# EAGLE schematic lab9 (EAGLE 7.0.0)
Lab 3 Jonathan Valvano
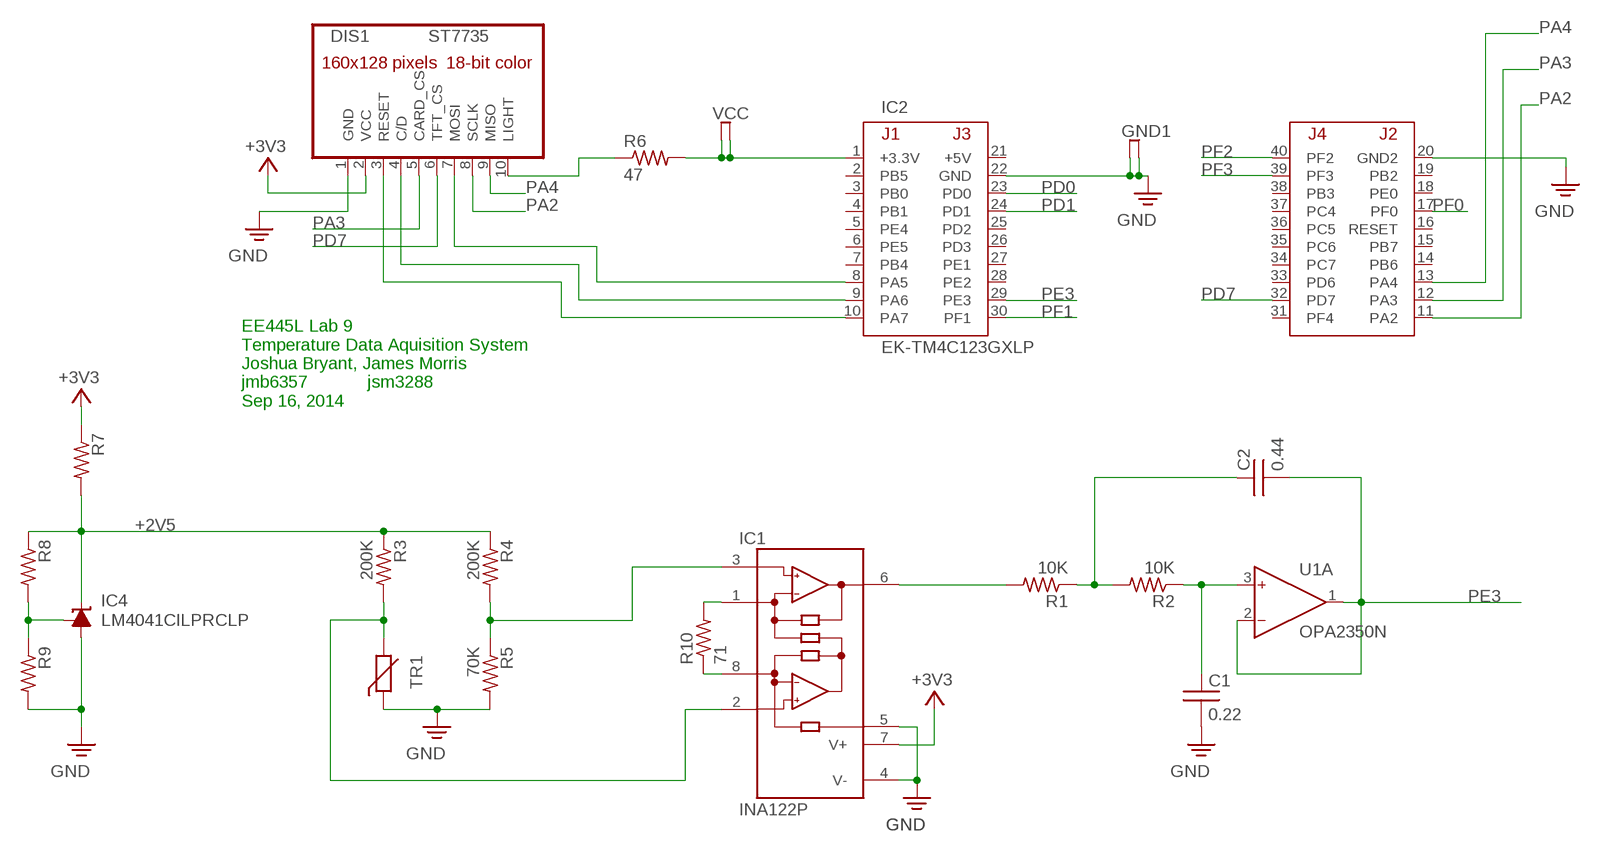
[diagram p0: schematic, sheet 1]

## Parts
C1  0.22  CAPACITOR050-024X044  [CAP200MIL]
C2  0.44  CAPACITOR050-024X044  [CAP200MIL]
DIS1  ST7735  [ST7735]
GND1  TP2  [TP2]
IC1  INA122P  [DIL08]
IC2  EK-TM4C123GXLP  [TM4C123LAUNCHPAD]
IC4  LM4041CILPRCLP  [LP_O-PBCY-W3]
R1  10K  RESISTOR0204/7  [RES300MIL]
R2  10K  RESISTOR0204/7  [RES300MIL]
R3  200K  RESISTOR0204/7  [RES300MIL]
R4  200K  RESISTOR0204/7  [RES300MIL]
R5  70K  RESISTOR0204/7  [RES300MIL]
R6  47  RESISTORV526-0  [RES_VERTICAL]
R7  RESISTOR0204/7  [RES300MIL]
R8  RESISTOR0204/7  [RES300MIL]
R9  RESISTOR0204/7  [RES300MIL]
R10  71  RESISTOR0204/7  [RES300MIL]
TR1  THERMISTOR  [1X02]
U1  OPA2350N  [DIL08]
VCC  TP2  [TP2]

## Nets
+2V5: IC4.2(C) R3.1 R4.1 R7.2 R8.1
+3V3: DIS1.2(VCC) IC1.7(V+) R7.1
GND: C1.2 DIS1.1(GND) GND1.MP1(TPB) GND1.MP(TPA) IC1.4(V-) IC1.5(REF) IC2.20(GND2) IC2.22(GND) IC4.3(A) R5.2 R9.2 TR1.1
LIGHT: DIS1.10(LIGHT) R6.1
N$1: IC2.1(+3.3V) R6.2 VCC.MP1(TPB) VCC.MP(TPA)
N$3: IC4.1(FB) R8.2 R9.1
N$4: IC1.1(RG) R10.2
N$5: IC1.8(RG) R10.1
N$6: C1.1 R2.1 U1.3(A:IN+)
N$7: C2.1 R1.1 R2.2
N$8: IC1.2(-IN) R3.2 TR1.2
N$9: IC1.3(+IN) R4.2 R5.1
N$10: IC1.6(OUT) R1.2
PA2: DIS1.8(SCLK) IC2.11(PA2)
PA3: DIS1.5(CARD_CS) IC2.12(PA3)
PA4: DIS1.9(MISO) IC2.13(PA4)
PA5: DIS1.7(MOSI) IC2.8(PA5)
PA6: DIS1.4(C/D) IC2.9(PA6)
PA7: DIS1.3(RESET) IC2.10(PA7)
PD0: IC2.23(PD0)
PD1: IC2.24(PD1)
PD7: DIS1.6(TFT_CS) IC2.32(PD7)
PE3: C2.2 IC2.29(PE3) U1.1(A:OUT) U1.2(A:IN-)
PF0: IC2.17(PF0)
PF2: IC2.40(PF2)
Unconnected: IC2.2(PB5) IC2.3(PB0) IC2.4(PB1) IC2.5(PE4) IC2.6(PE5) IC2.7(PB4) IC2.14(PB6) IC2.15(PB7) IC2.16(RESET) IC2.18(PE0) IC2.19(PB2) IC2.25(PD2) IC2.26(PD3) IC2.27(PE1) IC2.28(PE2) IC2.30(PF1) IC2.31(PF4) IC2.33(PD6) IC2.34(PC7) IC2.35(PC6) IC2.36(PC5) IC2.37(PC4) IC2.38(PB3) IC2.39(PF3) U1.5(B:IN+) U1.6(B:IN-) U1.7(B:OUT)

## Notes on the sheet
- EE445L Lab 9
  Temperature Data Aquisition System
  Joshua Bryant, James Morris
  jmb6357            jsm3288
  Sep 16, 2014

## Power pins joined to a net without a drawn wire
+5V: IC2.21(+5V)
V+: U1.8(P:V+)
V-: U1.4(P:V-)

## Library data of the parts
C1 C2 = EE445L:CAPACITOR: CAPACITOR, American symbol
DIS1 = EE445L:ST7735: Sitronix ST7735R 18-bit color, 1.8" TFT LCD display, 128*160, http://www.adafruit.com/products/358 // Backlight (pin 10) connected to +3.3 V // MISO (pin 9) PA4 (SSI0Rx) // SCK (pin 8) connected to PA2 (SSI0Clk) // MOSI (pin 7) connected to PA5 (SSI0Tx) // TFT_CS (pin 6) connected to PA3 (SSI0Fss) // CARD_CS (pin 5) connected to PD7 GPIO output(for SDC) // Data/Command (pin 4) connected to PA6 (GPIO), high for data, low for command // RESET (pin 3) connected to PA7 (GPIO) // VCC (pin 2) connected to +3.3 V // Gnd (pin 1) connected to ground; OC_FARNELL: unknown; OC_NEWARK: unknown
GND1 VCC = EE445L:TP2: Low-cost test point Made with two 0.8mm holes.
IC1 = EE445L:INA122: Instrumentation Amplifier Single Supply, MicroPower, Single Supply: 2.2V to 36V, offset 250uV, G = 5 + 200k/RG, bandwidth is 120 kHz at gain=5; MF: TEXAS INSTRUMENTS; MPN: INA122P; OC_FARNELL: 1459460; OC_NEWARK: 15M0948
IC2 = EE445L:EK-TM4C123GXL: Texas Instruments TM4C123 LaunchPad EK-TM4C123GXL www.ti.com/tool/ek-tm4c123gxl
IC4 = EE445L:LM4041CILPR: PRECISION MICROPOWER SHUNT VOLTAGE REFERENCE Adjustable Output Source: http://focus.ti.com/lit/ds/slcs146e/slcs146e.pdf LM4041CILPR Let R1 be the resistor from Vref to +3.3V Let R2 be the resistor from Vref to FB Let R3 be the resistor from FB to ground Vref = 1.23*(1+R3/R2) Iref=(3.3V-Vref)/R1 - 100uA; MPN: LM4041CILP; OC_FARNELL: 1673945; OC_NEWARK: 50M8856
R1-R10 = EE445L:RESISTOR: RESISTOR, American symbol
TR1 = EE445L:THERMISTOR: Thermistor off PCB and connected with two wires.
U1 = EE445L:OPA2350: 2.7V to 5.5V Rail-to-Rail I/O Dual Amplifier High-Speed 38MHz, Single-Supply, slew rate 22V/us, 500uV offset, 4uV noise; OC_FARNELL: unknown; OC_NEWARK: unknown

## Net classes
0 default: clearance 0.205 mm